# Altium project Leica_EG1160 main board.PrjPcb
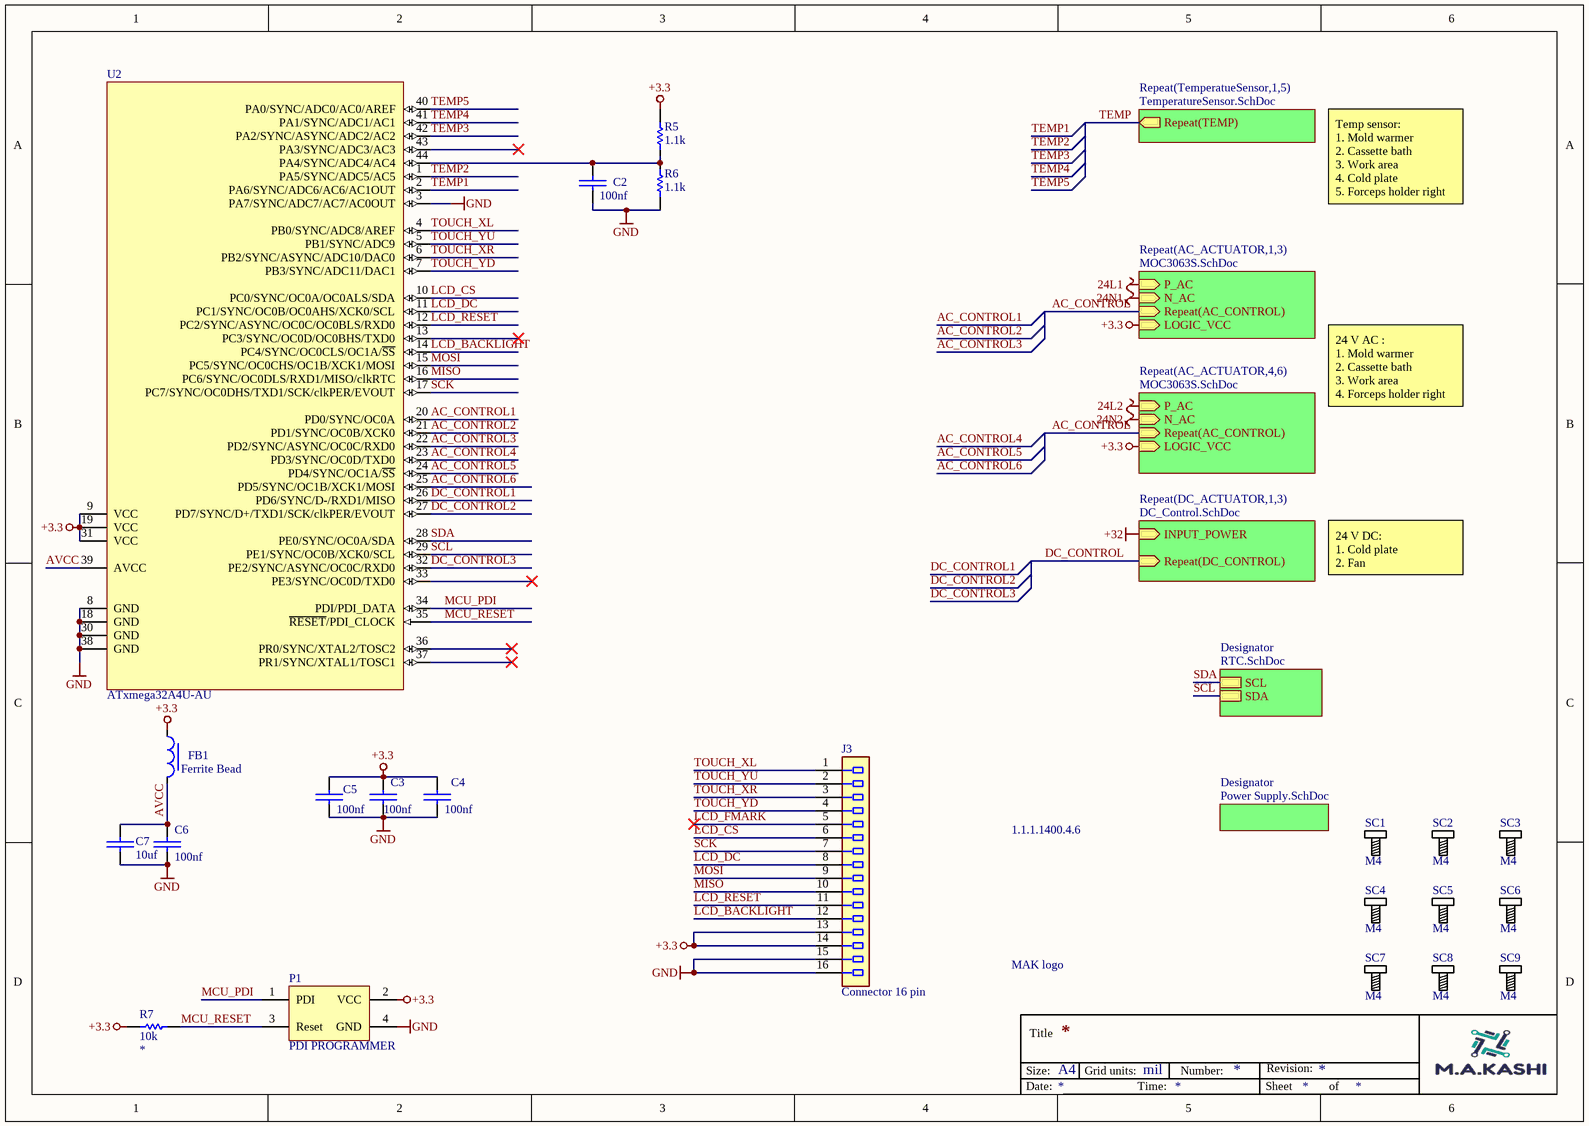
[diagram p0: main.SchDoc]
6 sheets, 146 parts. Net scope: hierarchical (ports join the sheet entries above them; power ports are global).
Board file: main.PcbDoc
Sheets:
  main.SchDoc
    TemperatueSensor1 = TemperatureSensor.SchDoc
    TemperatueSensor2 = TemperatureSensor.SchDoc
    TemperatueSensor3 = TemperatureSensor.SchDoc
    TemperatueSensor4 = TemperatureSensor.SchDoc
    TemperatueSensor5 = TemperatureSensor.SchDoc
    AC_ACTUATOR1 = MOC3063S.SchDoc
    AC_ACTUATOR2 = MOC3063S.SchDoc
    AC_ACTUATOR3 = MOC3063S.SchDoc
    DC_ACTUATOR1 = DC_Control.SchDoc
    DC_ACTUATOR2 = DC_Control.SchDoc
    DC_ACTUATOR3 = DC_Control.SchDoc
    Designator = Power Supply.SchDoc
    AC_ACTUATOR4 = MOC3063S.SchDoc
    AC_ACTUATOR5 = MOC3063S.SchDoc
    AC_ACTUATOR6 = MOC3063S.SchDoc
    Designator = RTC.SchDoc

## Sheet main.SchDoc
size 297 x 209 mm

### Parts
1.1.1.1400.4.6  MAK logo  [MAk LOGO]
C2  100nf  [cap_0805_A]
C3  100nf  [cap_0805_A]
C4  100nf  [cap_0805_A]
C5  100nf  [cap_0805_A]
C6  100nf  [cap_0805_A]
C7  10uf  [cap_0805_A]
FB1  Ferrite Bead  [FER_0805_A]
J3  Connector 16 pin  [DS1013-16S - with Latch/Eject Levers]
P1  PDI PROGRAMMER  [PDI]  (no BOM)
R5  1.1k  [RES_0805_A]
R6  1.1k  [RES_0805_A]
R7  10k  [RES_0805_A]
SC1  M4  [SCREW_M4]
SC2  M4  [SCREW_M4]
SC3  M4  [SCREW_M4]
SC4  M4  [SCREW_M4]
SC5  M4  [SCREW_M4]
SC6  M4  [SCREW_M4]
SC7  M4  [SCREW_M4]
SC8  M4  [SCREW_M4]
SC9  M4  [SCREW_M4]
U2  ATxmega32A4U-AU  [44A_L]

### Sub-sheets
Designator = Power Supply.SchDoc: no entries
Designator = RTC.SchDoc: SCL, SDA
Repeat(AC_ACTUATOR,1,3) = MOC3063S.SchDoc: P_AC (in), N_AC (in), Repeat(AC_CONTROL) (in), LOGIC_VCC (in)
Repeat(AC_ACTUATOR,4,6) = MOC3063S.SchDoc: P_AC (in), N_AC (in), Repeat(AC_CONTROL) (in), LOGIC_VCC (in)
Repeat(DC_ACTUATOR,1,3) = DC_Control.SchDoc: Repeat(DC_CONTROL) (in), INPUT_POWER (in)
Repeat(TemperatueSensor,1,5) = TemperatureSensor.SchDoc: Repeat(TEMP) (out)

### Nets
+3.3: C3.1 C4.1 C5.1 FB1.1 J3.13 J3.14 P1.2(VCC) R5.2 R7.1 U2.9(VCC) U2.19(VCC) U2.31(VCC) ; sheet Repeat(AC_ACTUATOR,1,3)/LOGIC_VCC, sheet Repeat(AC_ACTUATOR,4,6)/LOGIC_VCC
GND: C2.2 C3.2 C4.2 C5.2 C6.2 C7.2 J3.15 J3.16 P1.4(GND) R6.1 U2.3(PA7/SYNC/ADC7/AC7/AC0OUT) U2.8(GND) U2.18(GND) U2.30(GND) U2.38(GND)
AC_CONTROL: sheet Repeat(AC_ACTUATOR,1,3)/Repeat(AC_CONTROL), sheet Repeat(AC_ACTUATOR,4,6)/Repeat(AC_CONTROL)
AC_CONTROL1: U2.20(PD0/SYNC/OC0A)
AC_CONTROL2: U2.21(PD1/SYNC/OC0B/XCK0)
AC_CONTROL3: U2.22(PD2/SYNC/ASYNC/OC0C/RXD0)
AC_CONTROL4: U2.23(PD3/SYNC/OC0D/TXD0)
AC_CONTROL5: U2.24(PD4/SYNC/OC1A/~{SS})
AC_CONTROL6: U2.25(PD5/SYNC/OC1B/XCK1/MOSI)
AVCC: C6.1 C7.1 FB1.2 U2.39(AVCC)
DC_CONTROL: sheet Repeat(DC_ACTUATOR,1,3)/Repeat(DC_CONTROL)
DC_CONTROL1: U2.26(PD6/SYNC/D-/RXD1/MISO)
DC_CONTROL2: U2.27(PD7/SYNC/D+/TXD1/SCK/clkPER/EVOUT)
DC_CONTROL3: U2.32(PE2/SYNC/ASYNC/OC0C/RXD0)
LCD_BACKLIGHT: J3.12 U2.14(PC4/SYNC/OC0CLS/OC1A/~{SS})
LCD_CS: J3.6 U2.10(PC0/SYNC/OC0A/OC0ALS/SDA)
LCD_DC: J3.8 U2.11(PC1/SYNC/OC0B/OC0AHS/XCK0/SCL)
LCD_FMARK: J3.5
LCD_RESET: J3.11 U2.12(PC2/SYNC/ASYNC/OC0C/OC0BLS/RXD0)
MCU_PDI: P1.1(PDI) U2.34(PDI/PDI_DATA)
MCU_RESET: P1.3(Reset) R7.2 U2.35(~{RESET}/PDI_CLOCK)
MISO: J3.10 U2.16(PC6/SYNC/OC0DLS/RXD1/MISO/clkRTC)
MOSI: J3.9 U2.15(PC5/SYNC/OC0CHS/OC1B/XCK1/MOSI)
SCK: J3.7 U2.17(PC7/SYNC/OC0DHS/TXD1/SCK/clkPER/EVOUT)
SCL: U2.29(PE1/SYNC/OC0B/XCK0/SCL) ; sheet Designator/SDA
SDA: U2.28(PE0/SYNC/OC0A/SDA) ; sheet Designator/SCL
TEMP: sheet Repeat(TemperatueSensor,1,5)/Repeat(TEMP)
TEMP1: U2.2(PA6/SYNC/ADC6/AC6/AC1OUT)
TEMP2: U2.1(PA5/SYNC/ADC5/AC5)
TEMP3: U2.42(PA2/SYNC/ASYNC/ADC2/AC2)
TEMP4: U2.41(PA1/SYNC/ADC1/AC1)
TEMP5: U2.40(PA0/SYNC/ADC0/AC0/AREF)
TOUCH_XL: J3.1 U2.4(PB0/SYNC/ADC8/AREF)
TOUCH_XR: J3.3 U2.6(PB2/SYNC/ASYNC/ADC10/DAC0)
TOUCH_YD: J3.4 U2.7(PB3/SYNC/ADC11/DAC1)
TOUCH_YU: J3.2 U2.5(PB1/SYNC/ADC9)
NetC2_1: C2.1 R5.1 R6.2 U2.44(PA4/SYNC/ADC4/AC4)

Not connected (* = marked no-connect by the designer): U2 13(PC3/SYNC/OC0D/OC0BHS/TXD0)* 33(PE3/SYNC/OC0D/TXD0)* 36(PR0/SYNC/XTAL2/TOSC2)* 37(PR1/SYNC/XTAL1/TOSC1)* 43(PA3/SYNC/ADC3/AC3)*

### Notes on the sheet
- Temp sensor:
  1. Mold warmer
  2. Cassette bath
  3. Work area
  4. Cold plate
  5. Forceps holder right
- 24 V AC :
  1. Mold warmer
  2. Cassette bath
  3. Work area
  4. Forceps holder right
- 24 V DC:
  1. Cold plate
  2. Fan
- Size:
- Title
- A4
- Grid units:
- mil
- Number:
- Revision:
- Date:
- Time:
- Sheet
- of

### Library data of the parts
C2-C7 = Capacitor: octopart or digikey description!; Part Number: *; Voltage Rating: *
  C2-C6: Capacitance: 100nf
  C7: Capacitance: 10uf
FB1 = Ferrite Bead: octopart or digikey description!
P1 = PDI PROGRAMMER: Header, 3-Pin, Dual row; LatestRevisionDate: 17-Jul-2002; LatestRevisionNote: Re-released for DXP Platform.; Publisher: Altium Limited
R5 R6 = Resistor: octopart or digikey description!; Part Number: RC0402JR-07100RL; Resistance: 1.1k; Voltage Rating: *; Power Rating: *; Tolerance: *
R7 = Resistor: octopart or digikey description!; Part Number: *; Resistance: 10k; Voltage Rating: *; Power Rating: *; Tolerance: *
SC1-SC9 = Screw_M4: Screw
U2 = ATxmega32A4U-AU: 8/16-bit AVR XMEGA A4U Microcontroller, 1.6-3.6V, 32MHz, 32K + 4KB Flash, 1K EEPROM, 4K SRAM, 44-pin TQFP, Industrial Grade (-40°C to 85°C); DatasheetVersion: revB, Dec-2011; PackageVersion: revC, Oct-2010; PackageReference: 44A; PackageDescription: 44-Pin Plastic Thin Profile Quad Flat Pack, 10 x 10 x 1.0 mm Body, 0.8 mm Pitch (TQFP); Code_JEDEC: MS-026-ACB; ComponentLink1Description: Manufacturer URL; ComponentLink1URL: http://www.atmel.com/; ComponentLink2Description: ATxmega16A4U/32A4U/64A4U/128A4U Datasheet; ComponentLink2URL: http://www.atmel.com/dyn/resources/prod_documents/doc8387.pdf
J3 = Connector 16 pin: System: Connector

## Sheet TemperatureSensor.SchDoc: Temperature Sensor
size 148 x 105 mm; DocumentNumber: 9; SheetNumber: 9; SheetTotal: 10
Used 5 times, as channels TemperatueSensor1, TemperatueSensor2, TemperatueSensor3, TemperatueSensor4, TemperatueSensor5. Parts and nets are listed once, with the designators drawn on the sheet.
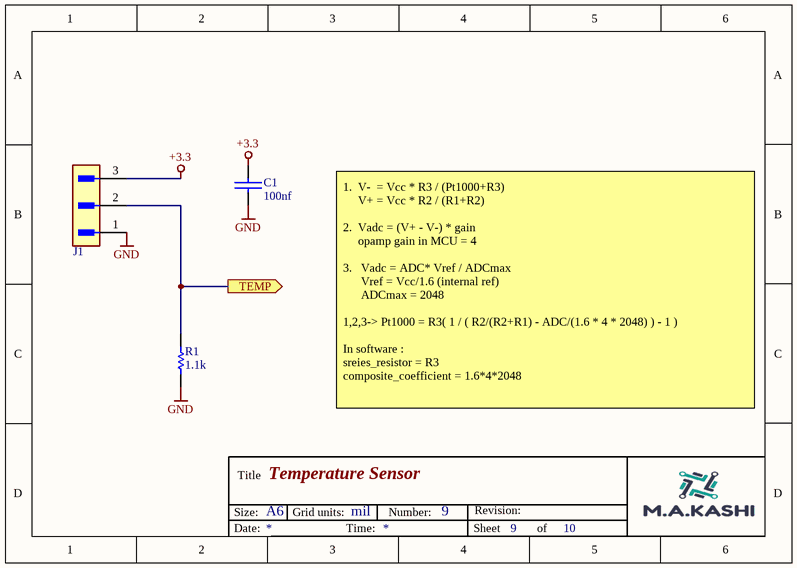
[diagram p1: TemperatureSensor.SchDoc]

### Parts
C1  100nf  [cap_0805_A]
J1  Connector  [Phoenix 3 0D]  (value not drawn)
R1  1.1k  [RES_0805_A]

### Ports
TEMP (out)

### Nets
+3.3: C1.2 J1.3
GND: C1.1 J1.1 R1.1
TEMP: J1.2 R1.2 ; port TEMP

### Channels
TemperatueSensor1: designators end in A; ports TEMP=TEMP1
TemperatueSensor2: designators end in B; ports TEMP=TEMP2
TemperatueSensor3: designators end in C; ports TEMP=TEMP3
TemperatueSensor4: designators end in D; ports TEMP=TEMP4
TemperatueSensor5: designators end in E; ports TEMP=TEMP5

### Notes on the sheet
- 1.  V-  = Vcc * R3 / (Pt1000+R3)
  V+ = Vcc * R2 / (R1+R2)
  2.  Vadc = (V+ - V-) * gain
  opamp gain in MCU = 4
  3.   Vadc = ADC* Vref / ADCmax
  Vref = Vcc/1.6 (internal ref)
  ADCmax = 2048
  1,2,3-> Pt1000 = R3( 1 / ( R2/(R2+R1) - ADC/(1.6 * 4 * 2048) ) - 1 )
  In software :
  sreies_resistor = R3
  composite_coefficient = 1.6*4*2048
- Size:
- Title
- A6
- Grid units:
- mil
- Number:
- Revision:
- Date:
- Time:
- Sheet
- of

### Library data of the parts
C1 = Capacitor: octopart or digikey description!; Part Number: C0402X7R160-104KNE; Capacitance: 100nf; Voltage Rating: *
J1 = Connector 3 pin
R1 = Resistor: as R5 on sheet main; Resistance: 1.1k; Voltage Rating: *; Power Rating: *; Tolerance: *

## Sheet MOC3063S.SchDoc: AC Actuator Control
size 148 x 105 mm; DocumentNumber: 7; SheetNumber: 7; SheetTotal: 10
Used 6 times, as channels AC_ACTUATOR1, AC_ACTUATOR2, AC_ACTUATOR3, AC_ACTUATOR4, AC_ACTUATOR5, AC_ACTUATOR6. Parts and nets are listed once, with the designators drawn on the sheet.
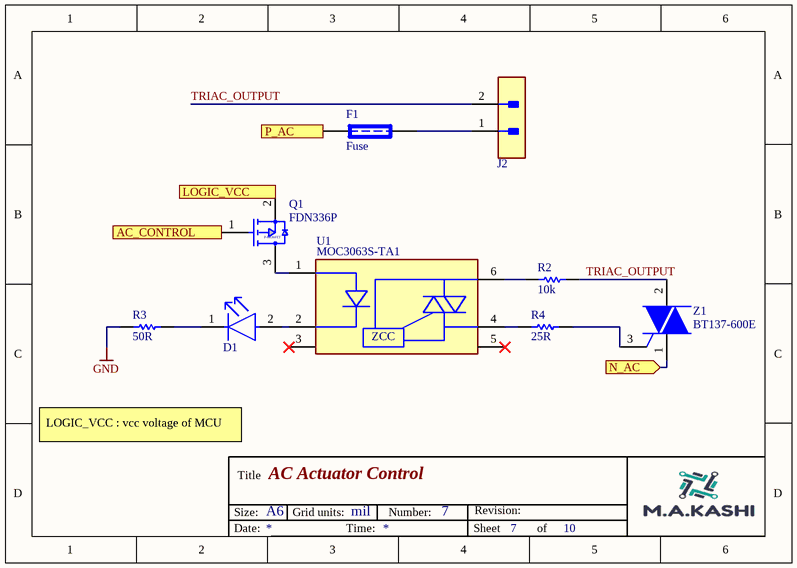
[diagram p2: MOC3063S.SchDoc]

### Parts
D1  LED  [LED_1206_red_Dialight]  (value not drawn)
F1  Fuse  [FUSE]
J2  Connector  [Phoenix 2 0D]  (value not drawn)
Q1  FDN336P  [ON_Semiconductor_527AG_IPC_A]
R2  10k  [RES_0805_A]
R3  50R  [RES_0805_A]
R4  25R  [RES_0805_A]
U1  Part Number: MOC3063S-TA1  [Lite-On_Inc._SMD6_0]  (hidden comment: IC_Lite-On_Inc._MOC3063S-TA1_eec)
Z1  BT137-600E  [sot78]

### Ports
AC_CONTROL (in), LOGIC_VCC (in), N_AC (in), P_AC (in)

### Nets
GND: R3.1
AC_CONTROL: Q1.1(G) ; port AC_CONTROL
LOGIC_VCC: Q1.2(S) ; port LOGIC_VCC
N_AC: Z1.1(T1) ; port N_AC
P_AC: F1.1 ; port P_AC
TRIAC_OUTPUT: J2.2 R2.2 Z1.2(T2)
NetD1_1: D1.1(C) R3.2
NetD1_2: D1.2(A) U1.2(C)
NetF1_2: F1.2 J2.1
NetQ1_3: Q1.3(D) U1.1(A)
NetR2_1: R2.1 U1.6(2_MAIN_TERMINAL)
NetR4_1: R4.1 U1.4(1_MAIN_TERMINAL)
NetR4_2: R4.2 Z1.3(G)

Not connected (* = marked no-connect by the designer): U1 3(NC)* 5(SUBSTRATE)*

### Channels
AC_ACTUATOR1: designators end in A; ports AC_CONTROL=AC_CONTROL1 LOGIC_VCC=+3.3 N_AC=24N1 P_AC=24L1
AC_ACTUATOR2: designators end in B; ports AC_CONTROL=AC_CONTROL2 LOGIC_VCC=+3.3 N_AC=24N1 P_AC=24L1
AC_ACTUATOR3: designators end in C; ports AC_CONTROL=AC_CONTROL3 LOGIC_VCC=+3.3 N_AC=24N1 P_AC=24L1
AC_ACTUATOR4: designators end in D; ports AC_CONTROL=AC_CONTROL4 LOGIC_VCC=+3.3 N_AC=24N2 P_AC=24L2
AC_ACTUATOR5: designators end in E; ports AC_CONTROL=AC_CONTROL5 LOGIC_VCC=+3.3 N_AC=24N2 P_AC=24L2
AC_ACTUATOR6: designators end in F; ports AC_CONTROL=AC_CONTROL6 LOGIC_VCC=+3.3 N_AC=24N2 P_AC=24L2

### Notes on the sheet
- LOGIC_VCC : vcc voltage of MCU
- Size:
- Title
- A6
- Grid units:
- mil
- Number:
- Revision:
- Date:
- Time:
- Sheet
- of
- (in symbol FDN336P) P-MOSFET
- (in symbol IC_Lite-On_Inc._MOC3063S-TA1_eec) ZCC

### Library data of the parts
D1 = LED: Part Number: Add part number!
J2 = Connector 2 pin: Manufacturer: JST; helpURL: https://upverter.com/upn/revision/9474e29b2dfd49db/; ComponentLink2Description: Datasheet; Temperature: -25°C to +85°C; Package: HDR02; Supplier 2: Mouser; Supplier 1: Digi-Key; ComponentLink1URL: https://upverter.com/upn/revision/9474e29b2dfd49db/; Supplier Part Number 1: 455-2247-ND; ComponentLink1Description: Upverter; ComponentLink2URL: https://upverter.com/datasheet/c48c44605c8b0d25ef64da6eae03f392f2e627c8.pdf; RoHS: TRUE; Temperature Range High: +85°C; Digikey Description: CONN HEADER XH TOP 2POS 2.5MM; Digikey Part Number: 455-2247-ND; Temperature Range Low: -25°C; Lead Free: yes
Q1 = FDN336P: Part Number: DMP3099L-13
R2 R4 = Resistor: octopart or digikey description!; Part Number: ERA-2AEB103X; Voltage Rating: *; Power Rating: *; Tolerance: *
  R2: Resistance: 10k
  R4: Resistance: 25R
R3 = Resistor: as R5 on sheet main; Resistance: 50R; Voltage Rating: *; Power Rating: *; Tolerance: *
U1 = IC_Lite-On_Inc._MOC3063S-TA1_eec: IC OPTOISOLATOR 5KV TRIAC 6SMD; Manufacturer: Lite-On Inc.; Mfg Package Ident: SMD6; helpURL: https://upverter.com/upn/revision/a56e6b8ee8ee0b41/; ComponentLink2Description: Datasheet; Temperature: -40°C to +110°C; Package: SMD6; Supplier 2: Mouser; Supplier 1: Digi-Key; ComponentLink1URL: https://upverter.com/upn/revision/a56e6b8ee8ee0b41/; Supplier Part Number 2: 859-MOC3063S-TA1; Supplier Part Number 1: 160-1723-1-ND; ComponentLink1Description: Upverter; ComponentLink2URL: http://optoelectronics.liteon.com/upload/download/DS70-2001-026/MOC306X%20series%20201606.pdf; RoHS: TRUE; Mouser Part Number: 859-MOC3063S-TA1; Temperature Range High: +110°C; Digikey Description: IC OPTOISOLATOR 5KV TRIAC 6SMD; Digikey Part Number: 160-1723-1-ND; Lead Free: yes; Temperature Range Low: -40°C
Z1 = BT137-600E: Part Number: Z0103MN
F1 = Fuse: Published: 8-Jun-2000; LatestRevisionDate: 17-Jul-2002; LatestRevisionNote: Re-released for DXP Platform.; PackageReference: PIN-W2/E2.8; Publisher: Altium Limited

## Sheet DC_Control.SchDoc
size 148 x 105 mm
Used 3 times, as channels DC_ACTUATOR1, DC_ACTUATOR2, DC_ACTUATOR3. Parts and nets are listed once, with the designators drawn on the sheet.
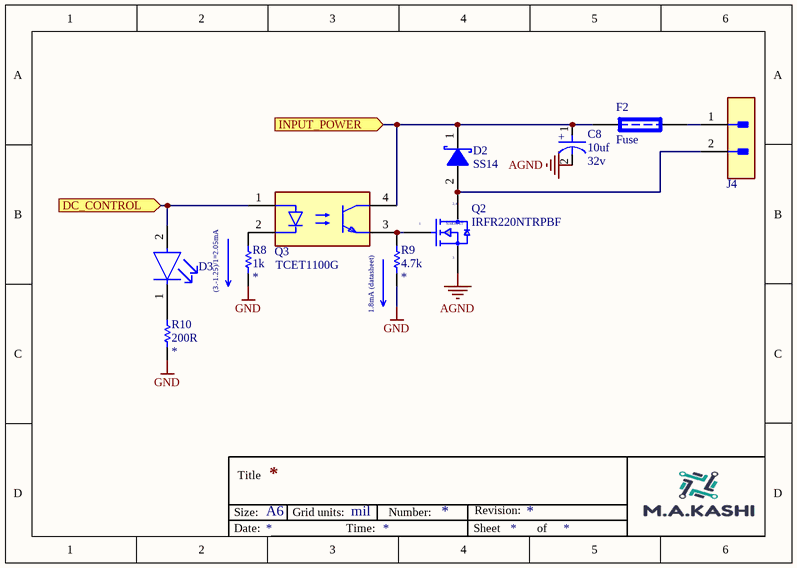
[diagram p3: DC_Control.SchDoc]

### Parts
C8  Capacitance: 10uf  Voltage: 32v  [CAP_electrolitic_5x5.4_Panasonic]  (hidden comment: Capacitor Electrolytic)
D2  SS14  [SS26FL_SS24FL_ONSemi_A]
D3  LED  [LED_0805_green_Dialight]  (value not drawn)
F2  Fuse  [FUSE]
J4  Connector  [Phoenix 2 0D]  (value not drawn)
Q2  IRFR220NTRPBF  [Infineon_PG-TO252-3_MFG]
Q3  TCET1100G  [DIP-4]
R8  1k  [RES_0805_A]
R9  4.7k  [RES_0805_A]
R10  200R  [RES_0805_A]

### Ports
DC_CONTROL (in), INPUT_POWER (in)

### Nets
AGND: C8.2(A) Q2.3(S)
GND: R8.2 R9.2 R10.2
DC_CONTROL: D3.2(A) Q3.1(A) ; port DC_CONTROL
INPUT_POWER: C8.1(C) D2.1(Cathode) F2.1 Q3.4(C) ; port INPUT_POWER
NetD2_2: D2.2(Anode) J4.2 Q2.4(D)
NetD3_1: D3.1(C) R10.1
NetF2_2: F2.2 J4.1
NetQ2_1: Q2.1(G) Q3.3(E) R9.1
NetQ3_2: Q3.2(C) R8.1

### Channels
DC_ACTUATOR1: designators end in A; ports DC_CONTROL=DC_CONTROL1 INPUT_POWER=+32
DC_ACTUATOR2: designators end in B; ports DC_CONTROL=DC_CONTROL2 INPUT_POWER=+32
DC_ACTUATOR3: designators end in C; ports DC_CONTROL=DC_CONTROL3 INPUT_POWER=+32

### Notes on the sheet
- (near R8) (3.-1.25)/1=2.05mA
- 1.8mA (datasheet)
- Size:
- Title
- A6
- Grid units:
- mil
- Number:
- Revision:
- Date:
- Time:
- Sheet
- of
- (in symbol Capacitor Electrolytic) +
- (in symbol IRFR220NTRPBF) 2,4; N-MOSFET

### Library data of the parts
D2 = Schottky Diode: Part Number: SS14
D3 = LED: Part Number: Add part number!
J4 = Connector 2 pin: Manufacturer: JST; helpURL: https://upverter.com/upn/revision/9474e29b2dfd49db/; ComponentLink2Description: Datasheet; Temperature: -25°C to +85°C; Package: HDR02; Supplier 2: Mouser; Supplier 1: Digi-Key; ComponentLink1URL: https://upverter.com/upn/revision/9474e29b2dfd49db/; Supplier Part Number 1: 455-2247-ND; ComponentLink1Description: Upverter; ComponentLink2URL: https://upverter.com/datasheet/c48c44605c8b0d25ef64da6eae03f392f2e627c8.pdf; RoHS: TRUE; Temperature Range High: +85°C; Digikey Description: CONN HEADER XH TOP 2POS 2.5MM; Digikey Part Number: 455-2247-ND; Temperature Range Low: -25°C; Lead Free: yes
Q2 = IRFR220NTRPBF: Part Number: DMP3099L-13
Q3 = Optocoupler-1ch: Part Number: TCET1100G
R8-R10 = Resistor: octopart or digikey description!; Part Number: *; Voltage Rating: *; Power Rating: *; Tolerance: *
  R8: Resistance: 1k
  R9: Resistance: 4.7k
  R10: Resistance: 200R
F2 = Fuse: Published: 8-Jun-2000; LatestRevisionDate: 17-Jul-2002; LatestRevisionNote: Re-released for DXP Platform.; PackageReference: PIN-W2/E2.8; Publisher: Altium Limited

## Sheet Power Supply.SchDoc
size 209 x 148 mm
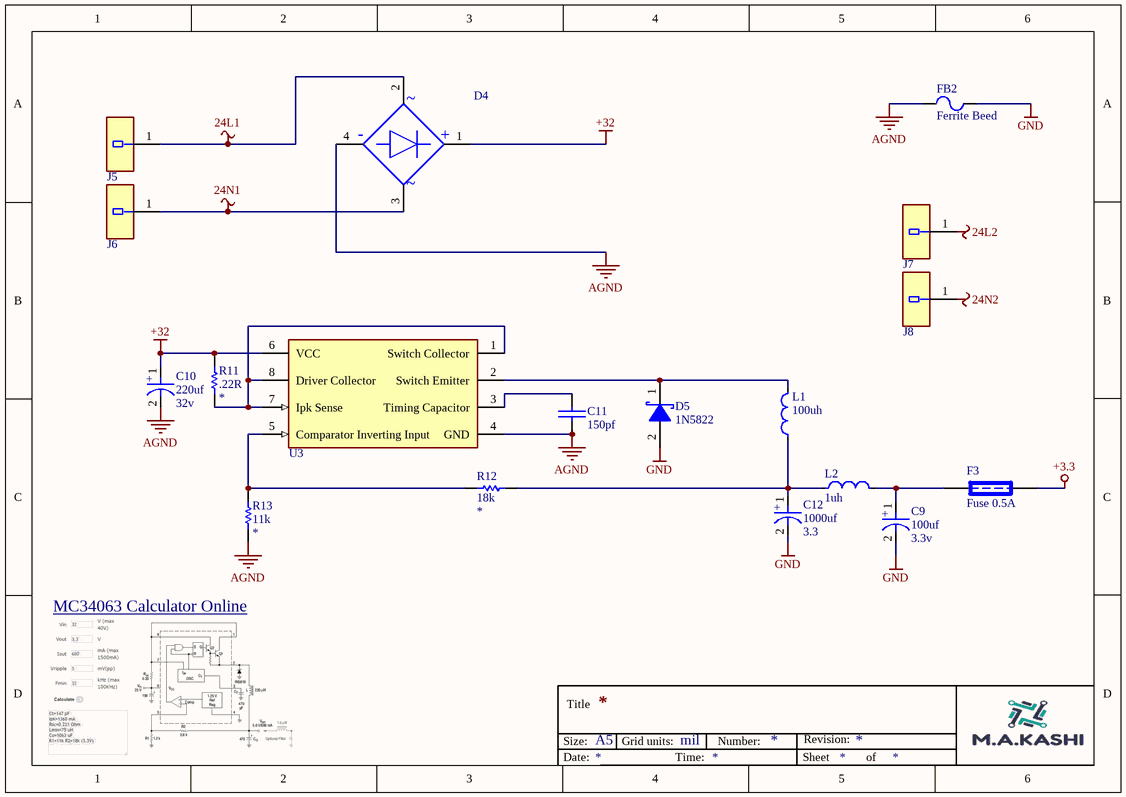
[diagram p4: Power Supply.SchDoc]

### Parts
C9  Capacitance: 100uf  Voltage: 3.3v  [CAP_electrolitic_8.3x10_Panasonic]  (hidden comment: Capacitor Electrolytic)
C10  Capacitance: 220uf  Voltage: 32v  [CAP_electrolitic_8.3x10_Panasonic]  (hidden comment: Capacitor Electrolytic)
C11  150pf  [cap_0805_A]
C12  Capacitance: 1000uf  Voltage: 3.3  [CAP_electrolitic_10x10.2_Panasonic]  (hidden comment: Capacitor Electrolytic)
D4  Bridge Rectifier  [Bridge Rectifier_Vishay_GBU_MFG]  (value not drawn)
D5  1N5822  [1N5822]
F3  Fuse 0.5A  [FUSE]
FB2  Ferrite Beed  [AXIAL-0.3]
J5  Quick-Fit  [Quick-Fit_Keystone_1287_0]  (value not drawn)
J6  Quick-Fit  [Quick-Fit_Keystone_1287_0]  (value not drawn)
J7  Quick-Fit  [Quick-Fit_Keystone_1287_0]  (value not drawn)
J8  Quick-Fit  [Quick-Fit_Keystone_1287_0]  (value not drawn)
L1  100uh  [INDUCTOR_SMD]
L2  1uh  [IND_DIP_7m]
R11  .22R  [RES_1206_A]
R12  18k  [RES_0805_A]
R13  11k  [RES_0805_A]
U3  MC33063ADR2G  [MC33063ADR2G_ON_Semiconductor_IPC_A]  (value not drawn)

### Nets
24L1: D4.2(1_~) J5.1
24L2: J7.1
24N1: D4.3(2_~) J6.1
24N2: J8.1
+3.3: F3.2
+32: C10.1(C) D4.1(+) R11.1 U3.6(VCC)
AGND: C10.2(A) C11.2 D4.4(-) FB2.2 R13.2 U3.4(GND)
GND: C9.2(A) C12.2(A) D5.2(Anode) FB2.1
NetC9_1: C9.1(C) F3.1 L2.2
NetC11_1: C11.1 U3.3(Timing_Capacitor)
NetC12_1: C12.1(C) L1.1 L2.1 R12.1
NetD5_1: D5.1(Cathode) L1.2 U3.2(Switch_Emitter)
NetR11_2: R11.2 U3.1(Switch_Collector) U3.7(Ipk_Sense) U3.8(Driver_Collector)
NetR12_2: R12.2 R13.1 U3.5(Comparator_Inverting_Input)

### Notes on the sheet
- MC34063 Calculator Online <https://www.bobtech.ro/tutoriale/componente-electronice/43-calculator-online-mc34063a-mc34063-step-down-step-up-inverter>
- Size:
- Title
- A5
- Grid units:
- mil
- Number:
- Revision:
- Date:
- Time:
- Sheet
- of
- (in symbol Bridge Rectifier) ~
- (in symbol Capacitor Electrolytic) +

### Library data of the parts
C11 = Capacitor: octopart or digikey description!; Part Number: *; Capacitance: 150pf; Voltage Rating: *
D4 = Bridge Rectifier: Part Number: GBL406
D5 = Schottky Diode: Part Number: 1N5822
F3 = Fuse: Published: 8-Jun-2000; LatestRevisionDate: 17-Jul-2002; LatestRevisionNote: Re-released for DXP Platform.; PackageReference: PIN-W2/E2.8; Publisher: Altium Limited
FB2 = Ferrite Beed: Code_IEC: 1005; Published: 8-Jun-2000; LatestRevisionDate: 17-Jul-2002; LatestRevisionNote: Re-released for DXP Platform.; PackageReference: 0402-A; Publisher: Altium Limited; Code_JEITA: 0402
L1 = Inductor: octopart or digikey description!; Part Number: NLV32T-101J-PF; Inductance: 100uh; Current Rating: *
L2 = Inductor: octopart or digikey description!; Part Number: *; Inductance: 1uh; Current Rating: *
R11-R13 = Resistor: octopart or digikey description!; Part Number: *; Voltage Rating: *; Power Rating: *; Tolerance: *
  R11: Resistance: .22R
  R12: Resistance: 18k
  R13: Resistance: 11k

## Sheet RTC.SchDoc
size 148 x 105 mm
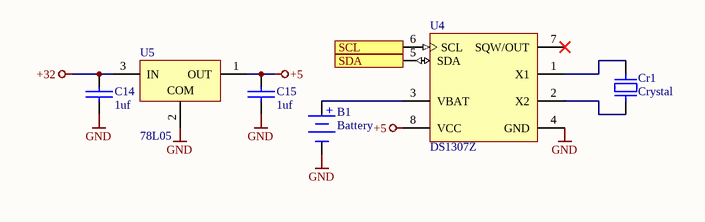
[diagram p5: RTC.SchDoc]

### Parts
B1  Battery  [20mm Coine Battery Holder]
C14  1uf  [cap_0805_A]
C15  1uf  [cap_0805_A]
Cr1  Crystal  [Crystal MC-405]
U4  DS1307Z  [SOIC_8_Maxim_M]
U5  78L05  [78L05]

### Ports
SCL, SDA

### Nets
+5: C15.1 U4.8(VCC) U5.1(OUT)
+32: C14.1 U5.3(IN)
GND: B1.2(-) C14.2 C15.2 U4.4(GND) U5.2(COM)
SCL: U4.5(SDA) ; port SDA
SDA: U4.6(SCL) ; port SCL
NetB1_1: B1.1(+) U4.3(VBAT)
NetCr1_1: Cr1.1 U4.2(X2)
NetCr1_2: Cr1.2 U4.1(X1)

Not connected (* = marked no-connect by the designer): U4 7(SQW/OUT)*

### Notes on the sheet
- Size:
- Title
- A6
- Grid units:
- mil
- Number:
- Revision:
- Date:
- Time:
- Sheet
- of

### Library data of the parts
C14 C15 = Capacitor: octopart or digikey description!; Part Number: *; Capacitance: 1uf; Voltage Rating: *
U4 = DS1307Z: 64 x 8, Serial, I2C Real-Time Clock, 5.0V, 8-Pin SO, 0 to 70 degC; ComponentLink1Description: Manufacturer URL; ComponentLink2Description: Datasheet; DatasheetVersion: 10-Feb-2008; ComponentLink3URL: http://pdfserv.maxim-ic.com/package_dwgs/21-0041.PDF; ComponentLink3Description: Package Specification; ComponentLink1URL: http://www.maxim-ic.com; Code_JEDEC: MS-012-AA; Code_IPC: SOIC127P600-8; PackageVersion: revC, 2010; PackageDescription: 8-Pin Small-Outline IC, Narrow (0.15in), 1.27 mm Pitch, SOIC (N); ComponentLink2URL: http://datasheets.maxim-ic.com/en/ds/DS1307.pdf; PackageReference: S8-2; PartNumber: DS1307Z
U5 = 78L05: Fixed Regulator with 7 to 20 V Input and 5 V Output, 0 to 125 degC, 3-Pin TO-92 (LP), Pb-Free (RoHS); PartNumber: UA78L05ACLPR; Manufacturer: Texas Instruments; Vout(Min)(V): 5; Vin(Min)(V): 7; SubFamily: Single Channel LDO; Iq(Typ)(mA): 6; Vin(Max)(V): 20; Iout(Max)(A): 0.1; Eco-Plan: Pb-Free (RoHS); ComponentLink1Description: Datasheet; ComponentLink2Description: Package Specification; DatasheetVersion: SLVS010S; ComponentLink3URL: Samples URL:http://www.ti.com/product/ua79m05#samples; ComponentLink1URL: http://www.ti.com/general/docs/lit/getliterature.tsp?genericPartNumber=UA78L05A&fileType=pdf; Code_JEDEC: TO-226-AA; ComponentLink2URL: http://www.ti.com/litv/pdf/msot002a; PackageReference: LP0003A; ComponentLink3Description: URL Link1; PackageVersion: revC, Oct-2001; Vout(Max)(V): 5; Mounting Technology: Through Hole; PackageDescription: Plastic Cylindrical Package, Formed Lead Option (TO-92)

## Nets that join several sheets
24L1: AC_ACTUATOR1 (F1A.1), AC_ACTUATOR2 (F1B.1), AC_ACTUATOR3 (F1C.1), Power Supply (D4.2 J5.1)
24L2: Power Supply (J7.1), AC_ACTUATOR4 (F1D.1), AC_ACTUATOR5 (F1E.1), AC_ACTUATOR6 (F1F.1)
24N1: AC_ACTUATOR1 (Z1A.1), AC_ACTUATOR2 (Z1B.1), AC_ACTUATOR3 (Z1C.1), Power Supply (D4.3 J6.1)
24N2: Power Supply (J8.1), AC_ACTUATOR4 (Z1D.1), AC_ACTUATOR5 (Z1E.1), AC_ACTUATOR6 (Z1F.1)
+3.3: main (12 pins), TemperatueSensor1 (C1A.2 J1A.3), TemperatueSensor2 (C1B.2 J1B.3), TemperatueSensor3 (C1C.2 J1C.3), TemperatueSensor4 (C1D.2 J1D.3), TemperatueSensor5 (C1E.2 J1E.3), AC_ACTUATOR1 (Q1A.2), AC_ACTUATOR2 (Q1B.2), AC_ACTUATOR3 (Q1C.2), Power Supply (F3.2), AC_ACTUATOR4 (Q1D.2), AC_ACTUATOR5 (Q1E.2), AC_ACTUATOR6 (Q1F.2)
+32: DC_ACTUATOR1 (C8A.1 D2A.1 F2A.1 Q3A.4), DC_ACTUATOR2 (C8B.1 D2B.1 F2B.1 Q3B.4), DC_ACTUATOR3 (C8C.1 D2C.1 F2C.1 Q3C.4), Power Supply (C10.1 D4.1 R11.1 U3.6), RTC (C14.1 U5.3)
AGND: DC_ACTUATOR1 (C8A.2 Q2A.3), DC_ACTUATOR2 (C8B.2 Q2B.3), DC_ACTUATOR3 (C8C.2 Q2C.3), Power Supply (6 pins)
GND: main (15 pins), TemperatueSensor1 (C1A.1 J1A.1 R1A.1), TemperatueSensor2 (C1B.1 J1B.1 R1B.1), TemperatueSensor3 (C1C.1 J1C.1 R1C.1), TemperatueSensor4 (C1D.1 J1D.1 R1D.1), TemperatueSensor5 (C1E.1 J1E.1 R1E.1), AC_ACTUATOR1 (R3A.1), AC_ACTUATOR2 (R3B.1), AC_ACTUATOR3 (R3C.1), DC_ACTUATOR1 (R8A.2 R9A.2 R10A.2), DC_ACTUATOR2 (R8B.2 R9B.2 R10B.2), DC_ACTUATOR3 (R8C.2 R9C.2 R10C.2), Power Supply (C9.2 C12.2 D5.2 FB2.1), AC_ACTUATOR4 (R3D.1), AC_ACTUATOR5 (R3E.1), AC_ACTUATOR6 (R3F.1), RTC (5 pins)
AC_CONTROL1: main (U2.20), AC_ACTUATOR1 (Q1A.1)
AC_CONTROL2: main (U2.21), AC_ACTUATOR2 (Q1B.1)
AC_CONTROL3: main (U2.22), AC_ACTUATOR3 (Q1C.1)
AC_CONTROL4: main (U2.23), AC_ACTUATOR4 (Q1D.1)
AC_CONTROL5: main (U2.24), AC_ACTUATOR5 (Q1E.1)
AC_CONTROL6: main (U2.25), AC_ACTUATOR6 (Q1F.1)
DC_CONTROL1: main (U2.26), DC_ACTUATOR1 (D3A.2 Q3A.1)
DC_CONTROL2: main (U2.27), DC_ACTUATOR2 (D3B.2 Q3B.1)
DC_CONTROL3: main (U2.32), DC_ACTUATOR3 (D3C.2 Q3C.1)
SCL: main (U2.29), RTC (U4.5)
SDA: main (U2.28), RTC (U4.6)
TEMP1: main (U2.2), TemperatueSensor1 (J1A.2 R1A.2)
TEMP2: main (U2.1), TemperatueSensor2 (J1B.2 R1B.2)
TEMP3: main (U2.42), TemperatueSensor3 (J1C.2 R1C.2)
TEMP4: main (U2.41), TemperatueSensor4 (J1D.2 R1D.2)
TEMP5: main (U2.40), TemperatueSensor5 (J1E.2 R1E.2)